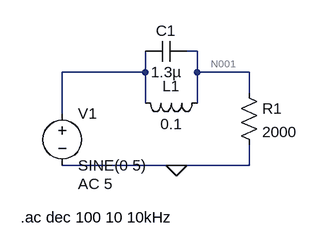
[diagram p0: schematic notchfilter.asc]
notchfilter.asc, the LTspice schematic file:
Version 4.1
SHEET 1 880 680
WIRE 240 32 224 32
WIRE 160 64 160 32
WIRE 160 64 32 64
WIRE 240 64 240 32
WIRE 320 64 240 64
WIRE 320 96 320 64
WIRE 160 112 160 64
WIRE 240 112 240 64
WIRE 32 128 32 64
WIRE 208 208 32 208
WIRE 320 208 320 176
WIRE 320 208 208 208
FLAG 208 208 0
SYMBOL voltage 32 112 R0
WINDOW 123 24 124 Left 2
WINDOW 39 0 0 Left 0
SYMATTR Value2 AC 5
SYMATTR InstName V1
SYMATTR Value SINE(0 5)
SYMBOL ind 256 96 R90
WINDOW 0 5 56 VBottom 2
WINDOW 3 32 56 VTop 2
SYMATTR InstName L1
SYMATTR Value 0.1
SYMATTR SpiceLine Rser=1m
SYMBOL cap 224 16 R90
WINDOW 0 0 32 VBottom 2
WINDOW 3 32 32 VTop 2
SYMATTR InstName C1
SYMATTR Value 1.3µ
SYMBOL res 304 80 R0
SYMATTR InstName R1
SYMATTR Value 2000
TEXT -32 288 Left 2 !.ac dec 100 10 10kHz

The netlist it stands for:
* notchfilter.asc
V1 N002 0 SINE(0 5) AC 5
L1 N001 N002 0.1 Rser=1m
C1 N001 N002 1.3µ
R1 N001 0 2000
.ac dec 100 10 10kHz
.backanno
.end

* Results of the author's LTspice run, read from the files saved beside the schematic
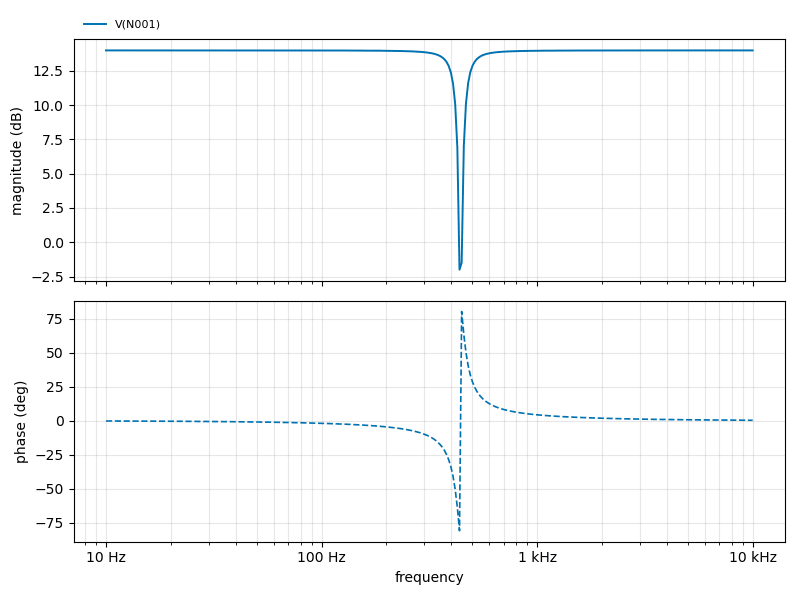
[diagram p1: AC Analysis of notchfilter.asc, plotted from the saved traces]
* AC Analysis, 1 run:
*   V(N001): 13.98 dB at 10 Hz, 13.98 dB at 10 kHz, peak 13.98 dB at 10 Hz, 3 dB below the peak at 411.1 Hz